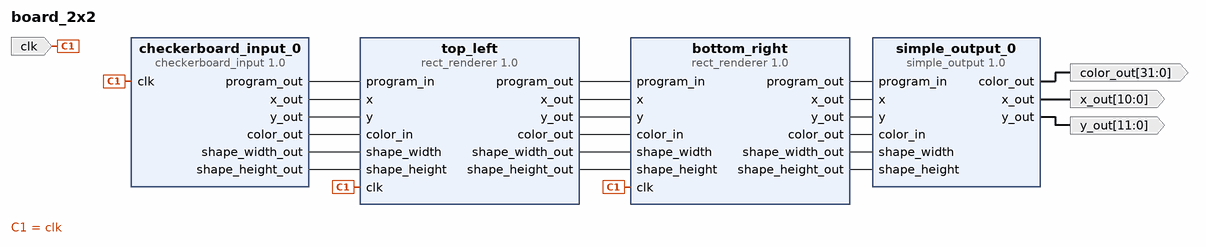
[diagram p0: block diagram of the top level]
# Vivado block design board_2x2, xc7a100tcsg324-1, Vivado 2018.3
create_bd_design board_2x2

create_bd_port -dir O -from 11 -to 0 y_out
create_bd_port -dir O -from 10 -to 0 x_out
create_bd_port -dir O -from 31 -to 0 color_out
create_bd_port -dir I -type clk clk
set_property -dict {CONFIG.PHASE 0.0} [get_bd_ports clk]

create_bd_cell -type ip -vlnv user.org:XUP:checkerboard_input:1.0 checkerboard_input_0
create_bd_cell -type ip -vlnv user.org:Renderer:rect_renderer:1.0 top_left
set_property -dict {CONFIG.SHAPE_ID 2} [get_bd_cells top_left]
create_bd_cell -type ip -vlnv user.org:Renderer:rect_renderer:1.0 bottom_right
set_property -dict {CONFIG.SHAPE_ID 3} [get_bd_cells bottom_right]
create_bd_cell -type ip -vlnv user.org:XUP:simple_output:1.0 simple_output_0

# ---- connections ----

connect_bd_net [get_bd_pins top_left/program_out] [get_bd_pins bottom_right/program_in]
connect_bd_net [get_bd_pins top_left/x_out] [get_bd_pins bottom_right/x]
connect_bd_net [get_bd_pins top_left/y_out] [get_bd_pins bottom_right/y]
connect_bd_net [get_bd_pins top_left/color_out] [get_bd_pins bottom_right/color_in]
connect_bd_net [get_bd_pins top_left/shape_width_out] [get_bd_pins bottom_right/shape_width]
connect_bd_net [get_bd_pins top_left/shape_height_out] [get_bd_pins bottom_right/shape_height]
connect_bd_net [get_bd_pins bottom_right/program_out] [get_bd_pins simple_output_0/program_in]
connect_bd_net [get_bd_pins bottom_right/x_out] [get_bd_pins simple_output_0/x]
connect_bd_net [get_bd_pins bottom_right/y_out] [get_bd_pins simple_output_0/y]
connect_bd_net [get_bd_pins bottom_right/color_out] [get_bd_pins simple_output_0/color_in]
connect_bd_net [get_bd_pins bottom_right/shape_width_out] [get_bd_pins simple_output_0/shape_width]
connect_bd_net [get_bd_pins bottom_right/shape_height_out] [get_bd_pins simple_output_0/shape_height]
connect_bd_net [get_bd_pins simple_output_0/y_out] [get_bd_ports y_out]
connect_bd_net [get_bd_pins simple_output_0/x_out] [get_bd_ports x_out]
connect_bd_net [get_bd_pins simple_output_0/color_out] [get_bd_ports color_out]
connect_bd_net -net clk_0_1 [get_bd_ports clk] [get_bd_pins checkerboard_input_0/clk] [get_bd_pins top_left/clk] [get_bd_pins bottom_right/clk]
connect_bd_net [get_bd_pins checkerboard_input_0/program_out] [get_bd_pins top_left/program_in]
connect_bd_net [get_bd_pins checkerboard_input_0/x_out] [get_bd_pins top_left/x]
connect_bd_net [get_bd_pins checkerboard_input_0/y_out] [get_bd_pins top_left/y]
connect_bd_net [get_bd_pins checkerboard_input_0/color_out] [get_bd_pins top_left/color_in]
connect_bd_net [get_bd_pins checkerboard_input_0/shape_width_out] [get_bd_pins top_left/shape_width]
connect_bd_net [get_bd_pins checkerboard_input_0/shape_height_out] [get_bd_pins top_left/shape_height]

validate_bd_design
save_bd_design
